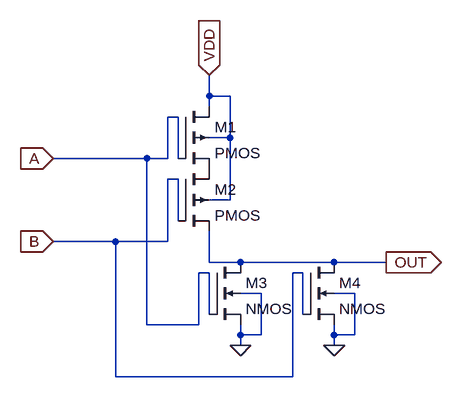
[diagram p0: schematic nor.asc]
nor.asc, the LTspice schematic file:
Version 4
SHEET 1 880 680
WIRE 352 0 352 -32
WIRE 384 0 352 0
WIRE 352 16 352 0
WIRE 304 32 288 32
WIRE 384 64 384 0
WIRE 384 64 352 64
WIRE 256 96 112 96
WIRE 288 96 288 32
WIRE 288 96 256 96
WIRE 304 96 304 32
WIRE 304 128 288 128
WIRE 384 160 384 64
WIRE 384 160 352 160
WIRE 304 192 304 128
WIRE 208 224 112 224
WIRE 288 224 288 128
WIRE 288 224 208 224
WIRE 352 256 352 208
WIRE 400 256 352 256
WIRE 544 256 400 256
WIRE 624 256 544 256
WIRE 352 272 336 272
WIRE 496 272 480 272
WIRE 432 304 400 304
WIRE 576 304 544 304
WIRE 352 336 352 272
WIRE 496 336 496 272
WIRE 256 352 256 96
WIRE 336 352 336 272
WIRE 336 352 256 352
WIRE 400 368 400 352
WIRE 432 368 432 304
WIRE 432 368 400 368
WIRE 544 368 544 352
WIRE 576 368 576 304
WIRE 576 368 544 368
WIRE 400 384 400 368
WIRE 544 384 544 368
WIRE 208 432 208 224
WIRE 480 432 480 272
WIRE 480 432 208 432
FLAG 352 -32 VDD
IOPIN 352 -32 In
FLAG 400 384 0
FLAG 544 384 0
FLAG 624 256 OUT
IOPIN 624 256 Out
FLAG 112 96 A
IOPIN 112 96 In
FLAG 112 224 B
IOPIN 112 224 In
SYMBOL pmos4 304 16 R0
SYMATTR InstName M1
SYMATTR Value2 l=90n w=400n
SYMBOL pmos4 304 112 R0
SYMATTR InstName M2
SYMATTR Value2 l=90n w=400n
SYMBOL nmos4 352 256 R0
SYMATTR InstName M3
SYMATTR Value2 l=90n w=200n
SYMBOL nmos4 496 256 R0
SYMATTR InstName M4
SYMATTR Value2 l=90n w=200n

The netlist it stands for:
* nor.asc
M1 VDD A P001 VDD PMOS l=90n w=400n
M2 P001 B OUT VDD PMOS l=90n w=400n
M3 OUT A 0 0 NMOS l=90n w=200n
M4 OUT B 0 0 NMOS l=90n w=200n
.model NMOS NMOS
.model PMOS PMOS
.lib standard.mos
.backanno
.end